# EAGLE design hoop_detector (EAGLE 8.6.0)
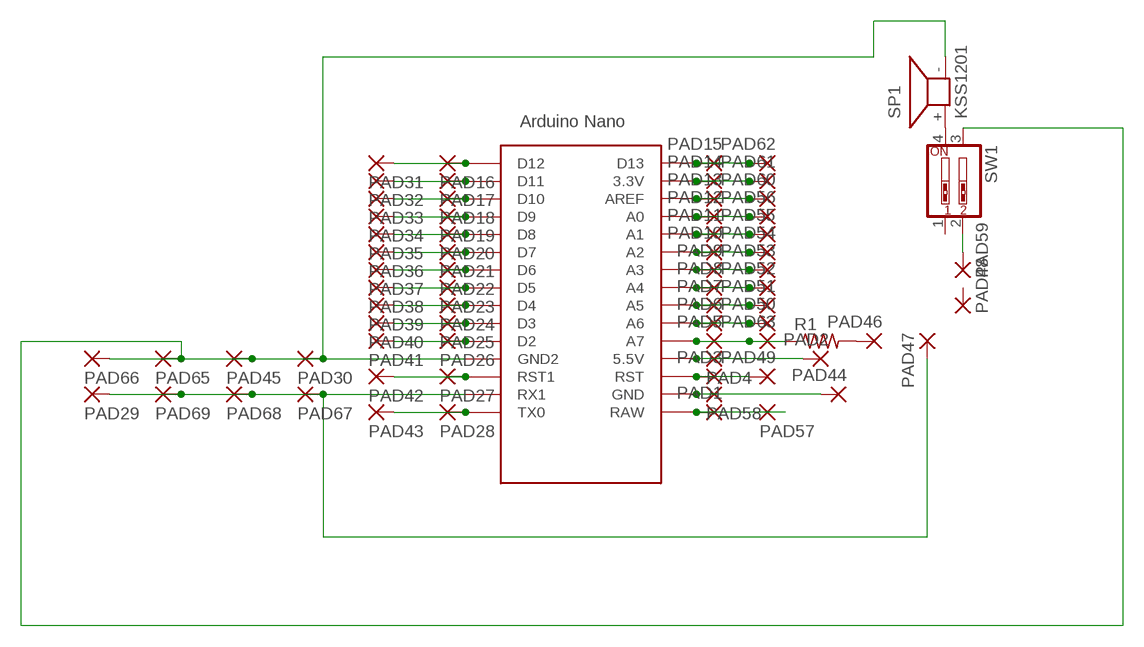
[diagram p0: schematic, sheet 1]

## Parts
PAD1  1,6/0,9  [1,6/0,9]
PAD2  1,6/0,9  [1,6/0,9]
PAD3  1,6/0,9  [1,6/0,9]
PAD4  1,6/0,9  [1,6/0,9]
PAD5  1,6/0,9  [1,6/0,9]
PAD6  1,6/0,9  [1,6/0,9]
PAD7  1,6/0,9  [1,6/0,9]
PAD8  1,6/0,9  [1,6/0,9]
PAD9  1,6/0,9  [1,6/0,9]
PAD10  1,6/0,9  [1,6/0,9]
PAD11  1,6/0,9  [1,6/0,9]
PAD12  1,6/0,9  [1,6/0,9]
PAD13  1,6/0,9  [1,6/0,9]
PAD14  1,6/0,9  [1,6/0,9]
PAD15  1,6/0,9  [1,6/0,9]
PAD16  1,6/0,9  [1,6/0,9]
PAD17  1,6/0,9  [1,6/0,9]
PAD18  1,6/0,9  [1,6/0,9]
PAD19  1,6/0,9  [1,6/0,9]
PAD20  1,6/0,9  [1,6/0,9]
PAD21  1,6/0,9  [1,6/0,9]
PAD22  1,6/0,9  [1,6/0,9]
PAD23  1,6/0,9  [1,6/0,9]
PAD24  1,6/0,9  [1,6/0,9]
PAD25  1,6/0,9  [1,6/0,9]
PAD26  1,6/0,9  [1,6/0,9]
PAD27  1,6/0,9  [1,6/0,9]
PAD28  1,6/0,9  [1,6/0,9]
PAD29  1,6/0,9  [1,6/0,9]
PAD30  1,6/0,9  [1,6/0,9]
PAD31  1,6/0,9  [1,6/0,9]
PAD32  1,6/0,9  [1,6/0,9]
PAD33  1,6/0,9  [1,6/0,9]
PAD34  1,6/0,9  [1,6/0,9]
PAD35  1,6/0,9  [1,6/0,9]
PAD36  1,6/0,9  [1,6/0,9]
PAD37  1,6/0,9  [1,6/0,9]
PAD38  1,6/0,9  [1,6/0,9]
PAD39  1,6/0,9  [1,6/0,9]
PAD40  1,6/0,9  [1,6/0,9]
PAD41  1,6/0,9  [1,6/0,9]
PAD42  1,6/0,9  [1,6/0,9]
PAD43  1,6/0,9  [1,6/0,9]
PAD44  1,6/0,9  [1,6/0,9]
PAD45  1,6/0,9  [1,6/0,9]
PAD46  1,6/0,9  [1,6/0,9]
PAD47  1,6/0,9  [1,6/0,9]
PAD48  1,6/0,9  [1,6/0,9]
PAD49  1,6/0,9  [1,6/0,9]
PAD50  1,6/0,9  [1,6/0,9]
PAD51  1,6/0,9  [1,6/0,9]
PAD52  1,6/0,9  [1,6/0,9]
PAD53  1,6/0,9  [1,6/0,9]
PAD54  1,6/0,9  [1,6/0,9]
PAD55  1,6/0,9  [1,6/0,9]
PAD56  1,6/0,9  [1,6/0,9]
PAD57  1,6/0,9  [1,6/0,9]
PAD58  1,6/0,9  [1,6/0,9]
PAD59  1,6/0,9  [1,6/0,9]
PAD60  1,6/0,9  [1,6/0,9]
PAD61  1,6/0,9  [1,6/0,9]
PAD62  1,6/0,9  [1,6/0,9]
PAD63  1,6/0,9  [1,6/0,9]
PAD65  1,6/0,9  [1,6/0,9]
PAD66  1,6/0,9  [1,6/0,9]
PAD67  1,6/0,9  [1,6/0,9]
PAD68  1,6/0,9  [1,6/0,9]
PAD69  1,6/0,9  [1,6/0,9]
R1  R-US_0204/7  [0204/7]
SP1  KSS1201  [KSS1201]
SW1  SW_DIP-2  [EDG-02]
U$1  NANO  [NANO]

## Nets
N$1: PAD18.1(P) PAD33.1(P) U$1.D10
N$2: PAD19.1(P) PAD34.1(P) U$1.D9
N$3: PAD20.1(P) PAD35.1(P) U$1.D8
N$4: PAD21.1(P) PAD36.1(P) U$1.D7
N$5: PAD22.1(P) PAD37.1(P) U$1.D6
N$6: PAD23.1(P) PAD38.1(P) U$1.D5
N$7: PAD24.1(P) PAD39.1(P) U$1.D4
N$8: PAD25.1(P) PAD40.1(P) U$1.D3
N$9: PAD26.1(P) PAD41.1(P) U$1.D2
N$10: PAD27.1(P) PAD42.1(P) U$1.RST1
N$11: PAD28.1(P) PAD43.1(P) U$1.TX0
N$12: PAD29.1(P) PAD47.1(P) PAD67.1(P) PAD68.1(P) PAD69.1(P) U$1.RX1
N$13: PAD30.1(P) PAD45.1(P) PAD65.1(P) PAD66.1(P) SW1.3 U$1.GND1(GND2)
N$14: PAD16.1(P) PAD31.1(P) U$1.D12
N$15: PAD17.1(P) PAD32.1(P) U$1.D11
N$17: PAD59.1(P) SW1.2
N$18: SP1.+ SW1.4
N$26: PAD5.1(P) PAD63.1(P) R1.1 U$1.A7
N$27: PAD2.1(P) PAD4.1(P) U$1.5V(5.5V)
N$28: PAD3.1(P) PAD49.1(P) U$1.RST
N$29: PAD44.1(P) PAD58.1(P) U$1.GND
N$30: PAD1.1(P) PAD57.1(P) U$1.RAW
N$36: SP1.-
N$38: PAD46.1(P) R1.2
N$39: PAD14.1(P) PAD61.1(P) U$1.3.3V
N$40: PAD13.1(P) PAD60.1(P) U$1.AREF
N$41: PAD12.1(P) PAD56.1(P) U$1.A0
N$42: PAD10.1(P) PAD54.1(P) U$1.A2
N$43: PAD9.1(P) PAD53.1(P) U$1.A3
N$44: PAD8.1(P) PAD52.1(P) U$1.A4
N$45: PAD7.1(P) PAD51.1(P) U$1.A5
N$46: PAD6.1(P) PAD50.1(P) U$1.A6
N$47: PAD11.1(P) PAD55.1(P) U$1.A1
N$48: PAD15.1(P) PAD62.1(P) U$1.D13
Unconnected: PAD48.1(P) SW1.1 U$1.ICSP1 U$1.ICSP2 U$1.ICSP3 U$1.ICSP4 U$1.ICSP5 U$1.ICSP6

## Library data of the parts
PAD1-PAD63 PAD65-PAD69 = wirepad:1,6/0,9: THROUGH-HOLE PAD
R1 = resistor:R-US_: RESISTOR, American symbol
SP1 = buzzer:KSS1201: SPEAKER Source: Schukat; OC_FARNELL: unknown; OC_NEWARK: unknown
SW1 = special:SW_DIP-2: DIP SWITCH
U$1 = Arduino-clone:NANO: Arduino Nano

## Board
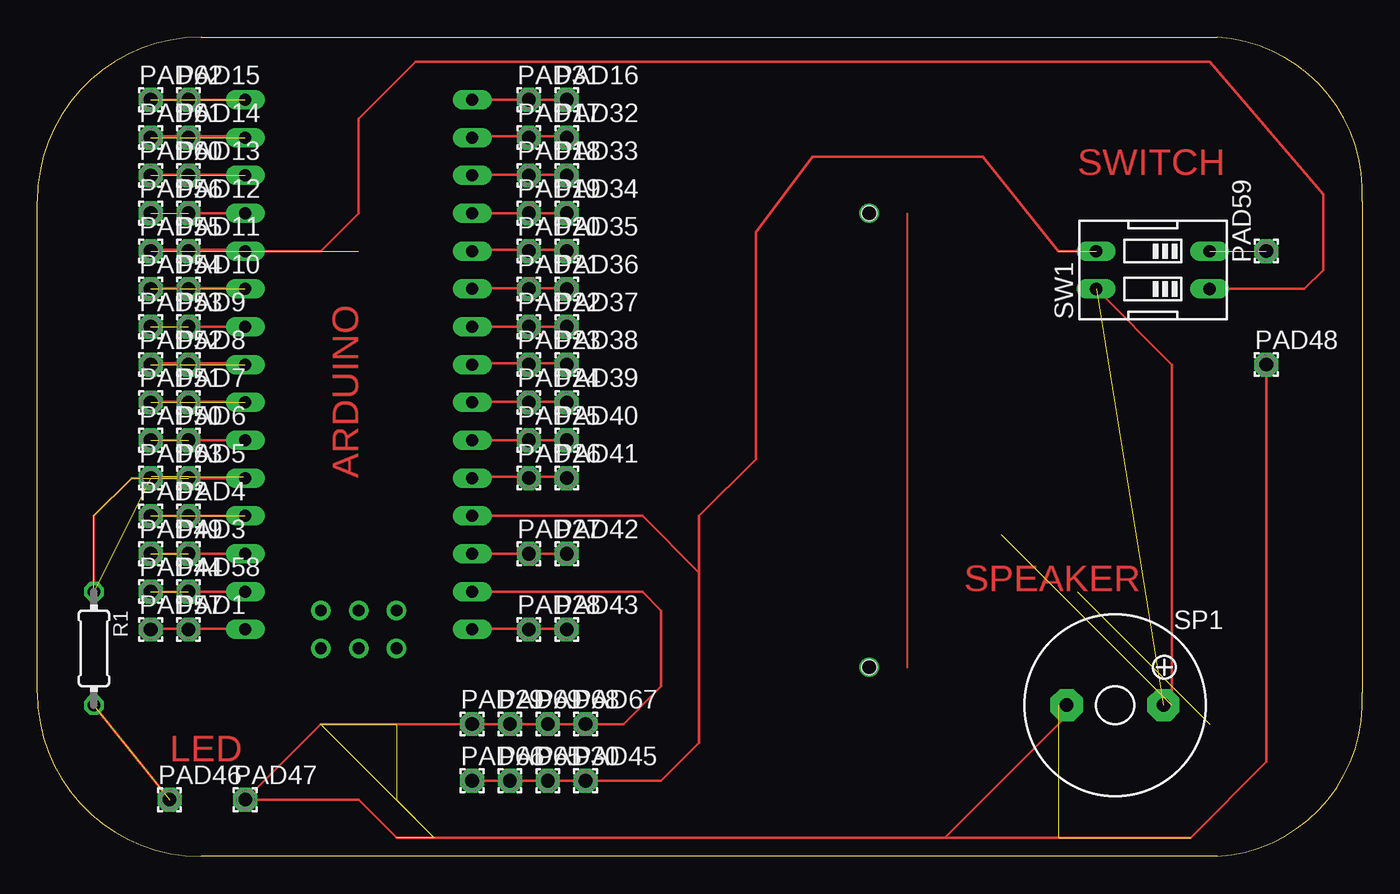
[diagram p1: board, top side]

Size 88.99 x 55 mm. Coordinates in mm from the lower left corner, seen from the top.
Outline: 11,55 79.25,55 arc-90 88.98,44 88.98,11 arc-90 79.25,0 11,0 arc-90 0,11 0,44 arc-90 11,55
Copper layers (1*16): Top 0.035mm / dielectric 1.5mm / Bottom 0.035mm
Design rules "default": minimum track width 6mil, minimum drill 0.35mm, track to track 6mil, track to pad 6mil, pad to pad 6mil, via to via 6mil, smd to smd 6mil, copper to edge 40mil, drill to drill 6mil, minimum pad ring 10mil, minimum via ring 8mil, stop-mask expansion 4mil, vias tented up to drill 0mil, thermal gap 10mil
Holes 1 mm at 55.88,43.18 55.88,12.7

### Footprints (pad centres in the part's own frame; a part is rotated, then mirrored left to right if it is on the bottom)
1,6/0,9 = drill 0.914 pad 1.6 octagon: 1 0,0
0204/7 = drill 0.813 octagon: 1 -3.81,0; 2 3.81,0
KSS1201 = drill 0.914 pad 2.159 octagon: + 3.251,0; - -3.251,0
EDG-02 = drill 0.813 long: 1 -1.27,-3.81; 2 1.27,-3.81; 3 1.27,3.81; 4 -1.27,3.81
NANO = drill 0.8 long: 3.3V -10.16,24.13; 5V -10.16,-1.27; A0 -10.16,19.05; A1 -10.16,16.51; A2 -10.16,13.97; A3 -10.16,11.43; A4 -10.16,8.89; A5 -10.16,6.35; A6 -10.16,3.81; A7 -10.16,1.27; AREF -10.16,21.59; D2 5.08,1.27; D3 5.08,3.81; D4 5.08,6.35; D5 5.08,8.89; D6 5.08,11.43; D7 5.08,13.97; D8 5.08,16.51; D9 5.08,19.05; D10 5.08,21.59; D11 5.08,24.13; D12 5.08,26.67; D13 -10.16,26.67; GND -10.16,-6.35; GND1 5.08,-1.27; RAW -10.16,-8.89; RST -10.16,-3.81; RST1 5.08,-3.81; RX1 5.08,-6.35; TX0 5.08,-8.89 | drill 0.8: ICSP1 -5.08,-10.16; ICSP2 -5.08,-7.62; ICSP3 -2.54,-10.16; ICSP4 -2.54,-7.62; ICSP5 0,-10.16; ICSP6 0,-7.62

### Placement (x,y rotation side)
PAD1  10.16,15.24 0 top
PAD2  7.62,22.86 0 top
PAD3  10.16,20.32 0 top
PAD4  10.16,22.86 0 top
PAD5  10.16,25.4 0 top
PAD6  10.16,27.94 0 top
PAD7  10.16,30.48 0 top
PAD8  10.16,33.02 0 top
PAD9  10.16,35.56 0 top
PAD10  10.16,38.1 0 top
PAD11  10.16,40.64 0 top
PAD12  10.16,43.18 0 top
PAD13  10.16,45.72 0 top
PAD14  10.16,48.26 0 top
PAD15  10.16,50.8 0 top
PAD16  35.56,50.8 0 top
PAD17  33.02,48.26 0 top
PAD18  33.02,45.72 0 top
PAD19  33.02,43.18 0 top
PAD20  33.02,40.64 0 top
PAD21  33.02,38.1 0 top
PAD22  33.02,35.56 0 top
PAD23  33.02,33.02 0 top
PAD24  33.02,30.48 0 top
PAD25  33.02,27.94 0 top
PAD26  33.02,25.4 0 top
PAD27  33.02,20.32 0 top
PAD28  33.02,15.24 0 top
PAD29  29.21,8.89 0 top
PAD30  34.29,5.08 0 top
PAD31  33.02,50.8 0 top
PAD32  35.56,48.26 0 top
PAD33  35.56,45.72 0 top
PAD34  35.56,43.18 0 top
PAD35  35.56,40.64 0 top
PAD36  35.56,38.1 0 top
PAD37  35.56,35.56 0 top
PAD38  35.56,33.02 0 top
PAD39  35.56,30.48 0 top
PAD40  35.56,27.94 0 top
PAD41  35.56,25.4 0 top
PAD42  35.56,20.32 0 top
PAD43  35.56,15.24 0 top
PAD44  7.62,17.78 0 top
PAD45  36.83,5.08 0 top
PAD46  8.89,3.81 0 top
PAD47  13.97,3.81 0 top
PAD48  82.55,33.02 0 top
PAD49  7.62,20.32 0 top
PAD50  7.62,27.94 0 top
PAD51  7.62,30.48 0 top
PAD52  7.62,33.02 0 top
PAD53  7.62,35.56 0 top
PAD54  7.62,38.1 0 top
PAD55  7.62,40.64 0 top
PAD56  7.62,43.18 0 top
PAD57  7.62,15.24 0 top
PAD58  10.16,17.78 0 top
PAD59  82.55,40.64 90 top
PAD60  7.62,45.72 0 top
PAD61  7.62,48.26 0 top
PAD62  7.62,50.8 0 top
PAD63  7.62,25.4 0 top
PAD65  31.75,5.08 0 top
PAD66  29.21,5.08 0 top
PAD67  36.83,8.89 0 top
PAD68  34.29,8.89 0 top
PAD69  31.75,8.89 0 top
R1  3.81,13.97 270 top
SP1  72.39,10.16 0 top
SW1  74.93,39.37 90 top
U$1  24.13,24.13 0 top

### Tracks (layer width: path | path; a pad name or v marks a point on that pad's centre or on a via)
N$1  (via drill 0.35)
  Top 0.152: 33.02,45.77 v29.26,45.77 U$1.D10 | 33.02,45.77 35.51,45.77 PAD33.1 | 33.02,45.77 PAD18.1
N$2
  Top 0.152: U$1.D9 PAD19.1 PAD34.1
N$3  (via drill 0.35)
  Top 0.152: 33.02,40.74 v29.26,40.74 U$1.D8 | 33.02,40.74 35.51,40.74 PAD35.1 | 33.02,40.74 PAD20.1
N$4  (via drill 0.35)
  Top 0.152: 33.02,38.15 v29.26,38.15 U$1.D7 | 33.02,38.15 35.51,38.15 PAD36.1 | 33.02,38.15 PAD21.1
N$5
  Top 0.152: U$1.D6 PAD22.1 PAD37.1
N$6  (via drill 0.35)
  Top 0.152: 33.02,33.12 v29.26,33.12 U$1.D5 | 33.02,33.12 35.51,33.12 PAD38.1 | 33.02,33.12 PAD23.1
N$7  (via drill 0.35)
  Top 0.152: 33.02,30.53 v29.26,30.53 U$1.D4 | 33.02,30.53 35.51,30.53 PAD39.1 | 33.02,30.53 PAD24.1
N$8
  Top 0.152: U$1.D3 PAD25.1 PAD40.1
N$9  (via drill 0.35)
  Top 0.152: 33.02,25.5 v29.26,25.5 U$1.D2 | 33.02,25.5 35.51,25.5 PAD41.1 | 33.02,25.5 PAD26.1
N$10
  Top 0.152: U$1.RST1 PAD27.1 PAD42.1
N$11  (via drill 0.35)
  Top 0.152: 33.02,15.29 v29.26,15.29 U$1.TX0 | 33.02,15.29 35.51,15.29 PAD43.1 | 33.02,15.29 PAD28.1
N$12  (8 unrouted)
  Top 0.152: U$1.RX1 40.64,17.78 41.91,16.51 41.91,11.43 39.37,8.89 PAD67.1 PAD68.1 PAD69.1 PAD29.1 19.05,8.89 PAD47.1 21.59,3.81 24.13,1.27 | 24.13,1.27 | 82.55,33.02 82.55,6.35 77.47,1.27 60.96,1.27 | 24.13,1.27 59.69,1.27 60.96,1.27 | 69.85,10.16 60.96,1.27
N$13  (1 unrouted)
  Top 0.152: PAD66.1 PAD65.1 PAD30.1 PAD45.1 41.91,5.08 44.45,7.62 44.45,19.05 | U$1.GND1 40.64,22.86 44.45,19.05 | 44.45,19.05 44.45,22.86 48.26,26.67 48.26,41.91 52.07,46.99 63.5,46.99 68.58,40.64 SW1.3
N$14
  Top 0.152: U$1.D12 PAD31.1 PAD16.1
N$15  (via drill 0.35)
  Top 0.152: 33.02,48.36 v29.26,48.36 U$1.D11 | 33.02,48.36 35.51,48.36 PAD32.1 | 33.02,48.36 PAD17.1
N$17  (1 unrouted)
N$18  (1 unrouted)
  Top 0.152: 76.2,10.16 76.2,33.02 SW1.4
N$20  (1 unrouted)
N$26  (via drill 0.35)  (6 unrouted)
  Top 0.152: v13.87,25.5 U$1.A7 6.35,25.4 3.81,22.86 R1.1 | 10.16,25.5 PAD5.1
N$27  (2 unrouted)
  Top 0.152: PAD2.1 U$1.5V
N$28  (1 unrouted)
  Top 0.152: U$1.RST PAD3.1 PAD49.1
N$29  (1 unrouted)
  Top 0.152: PAD44.1 U$1.GND
N$30  (via drill 0.35)
  Top 0.152: 10.16,15.29 v13.87,15.29 U$1.RAW | 10.16,15.29 7.67,15.29 PAD57.1 | 10.16,15.29 PAD1.1
N$31  (via drill 0.35 pad 1.3)
  other vias: 55.88,12.7
N$32  (via drill 0.35 pad 1.3)
  other vias: 55.88,43.18
N$37  (1 unrouted)
N$38  (1 unrouted)
  Top 0.152: R1.2 PAD46.1
N$39  (via drill 0.35)  (1 unrouted)
  Top 0.152: 10.16,48.36 v13.87,48.36 U$1.3.3V | 10.16,48.36 7.67,48.36 | 10.16,48.36 PAD14.1
N$40  (via drill 0.35)  (1 unrouted)
  Top 0.152: 10.16,45.77 v13.87,45.77 U$1.AREF | 10.16,45.77 7.67,45.77 | 10.16,45.77 PAD13.1
N$41  (1 unrouted)
  Top 0.152: PAD12.1 U$1.A0
N$42  (via drill 0.35)  (1 unrouted)
  Top 0.152: 10.16,38.15 v13.87,38.15 U$1.A2 | 10.16,38.15 7.67,38.15 | 10.16,38.15 PAD10.1
N$43  (1 unrouted)
  Top 0.152: PAD9.1 U$1.A3
N$44  (via drill 0.35)  (1 unrouted)
  Top 0.152: 10.16,33.12 v13.87,33.12 U$1.A4 | 10.16,33.12 7.67,33.12 | 10.16,33.12 PAD8.1
N$45  (via drill 0.35)  (1 unrouted)
  Top 0.152: 10.16,30.53 v13.87,30.53 U$1.A5 | 10.16,30.53 7.67,30.53 | 10.16,30.53 PAD7.1
N$46  (1 unrouted)
  Top 0.152: U$1.A6 PAD6.1 PAD50.1
N$47  (via drill 0.35)  (1 unrouted)
  Top 0.152: 78.74,38.1 85.09,38.1 86.36,39.37 86.36,44.45 78.74,53.34 25.4,53.34 21.59,49.53 21.59,43.18 19.05,40.64 U$1.A1 v13.87,40.74 10.16,40.74 | 10.16,40.74 7.67,40.74 | 10.16,40.74 PAD11.1
N$48  (2 unrouted)
  Top 0.152: PAD62.1 U$1.D13
(copper drawn outside any net)
  shapes: Top area x1

### Text on the board
Top: SWITCH | ARDUINO | SPEAKER | LED | CPE 233 Winter 2018 / Hoop Detector / Russell Caletena, Josiah Pang, / & Nathan Wang